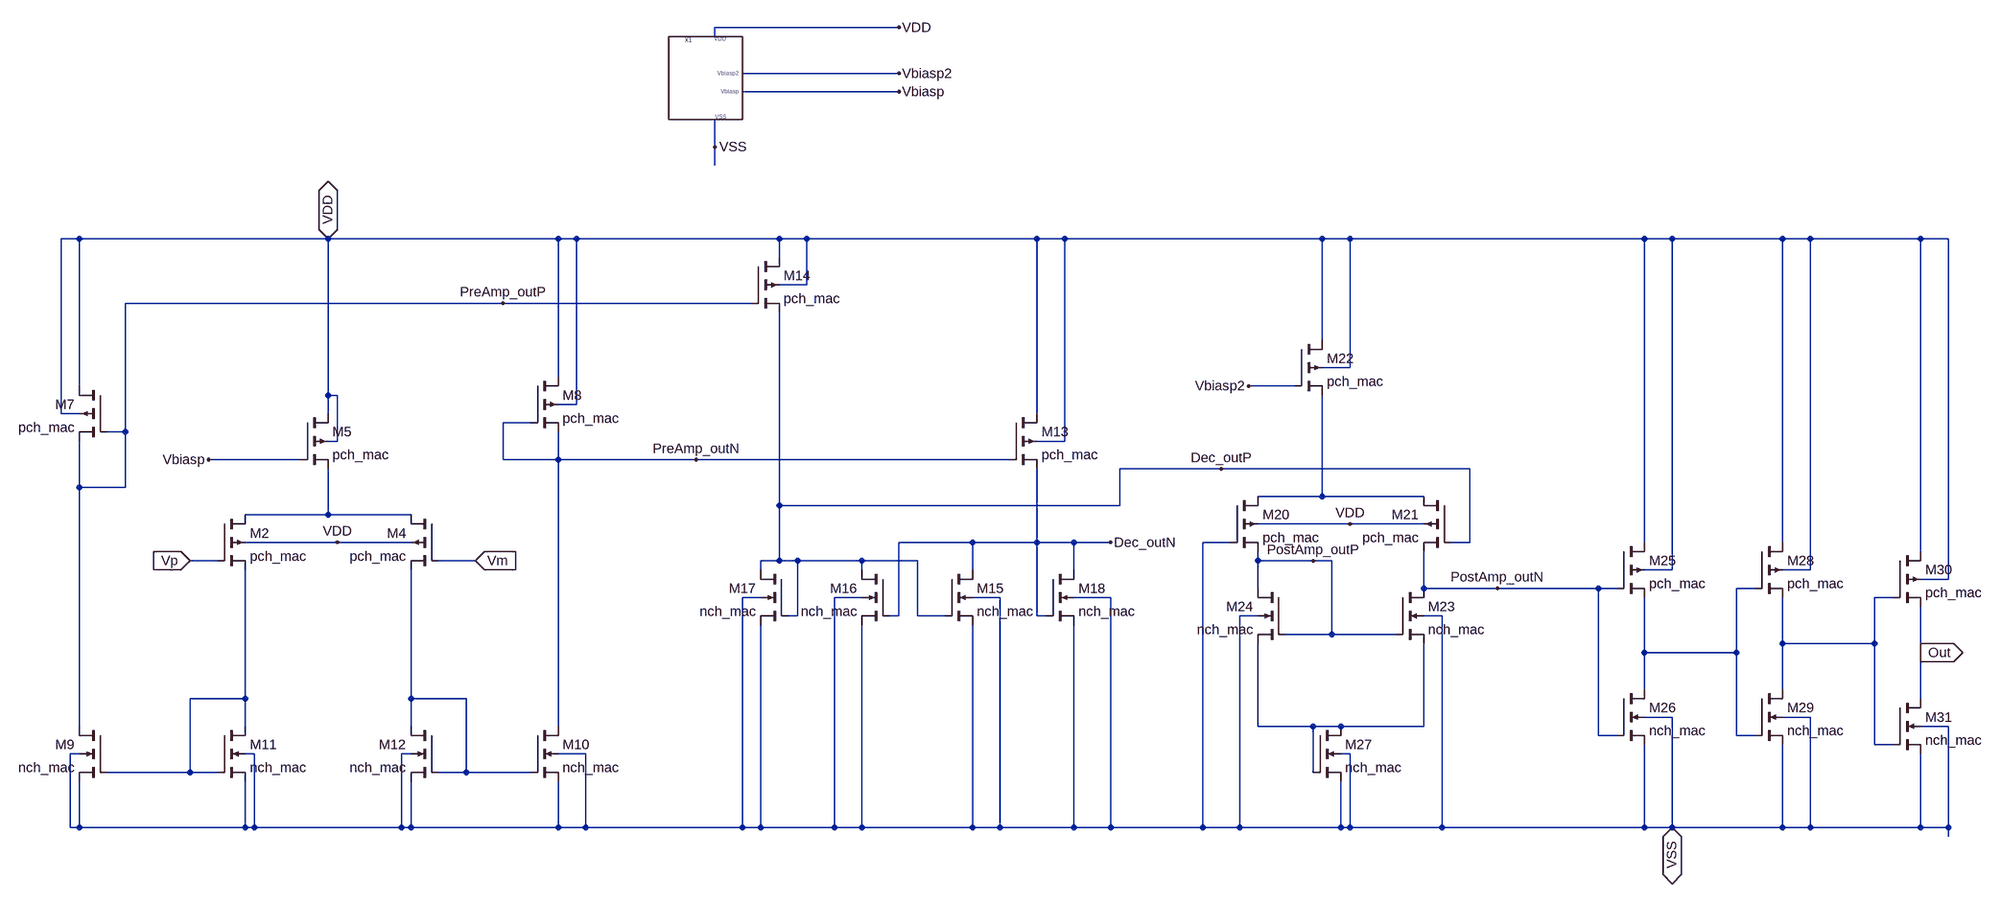
[diagram p0: schematic comparator.asc]
comparator.asc, the LTspice schematic file:
Version 4
SHEET 1 3148 740
WIRE 608 -848 288 -848
WIRE 288 -832 288 -848
WIRE 608 -768 336 -768
WIRE 608 -736 336 -736
WIRE 288 -640 288 -688
WIRE 288 -608 288 -640
WIRE -816 -480 -848 -480
WIRE -384 -480 -816 -480
WIRE 16 -480 -384 -480
WIRE 48 -480 16 -480
WIRE 400 -480 48 -480
WIRE 448 -480 400 -480
WIRE 848 -480 448 -480
WIRE 896 -480 848 -480
WIRE 1344 -480 896 -480
WIRE 1392 -480 1344 -480
WIRE 1904 -480 1392 -480
WIRE 1952 -480 1904 -480
WIRE 2144 -480 1952 -480
WIRE 2192 -480 2144 -480
WIRE 2384 -480 2192 -480
WIRE 2432 -480 2384 -480
WIRE 400 -448 400 -480
WIRE 448 -400 448 -480
WIRE 448 -400 400 -400
WIRE -80 -368 -736 -368
WIRE 352 -368 -80 -368
WIRE 1344 -304 1344 -480
WIRE 1392 -256 1392 -480
WIRE 1392 -256 1344 -256
WIRE 16 -240 16 -480
WIRE -816 -224 -816 -480
WIRE 1296 -224 1216 -224
WIRE -384 -208 -384 -480
WIRE -368 -208 -384 -208
WIRE 48 -192 48 -480
WIRE 48 -192 16 -192
WIRE -848 -176 -848 -480
WIRE -816 -176 -848 -176
WIRE -384 -176 -384 -208
WIRE 848 -176 848 -480
WIRE -32 -160 -80 -160
WIRE -736 -144 -736 -368
WIRE -736 -144 -768 -144
WIRE -368 -128 -368 -208
WIRE -368 -128 -384 -128
WIRE 896 -128 896 -480
WIRE 896 -128 848 -128
WIRE -432 -96 -592 -96
WIRE -80 -96 -80 -160
WIRE 16 -96 16 -144
WIRE 16 -96 -80 -96
WIRE 256 -96 16 -96
WIRE 800 -96 256 -96
WIRE 1168 -80 992 -80
WIRE 1600 -80 1168 -80
WIRE -816 -48 -816 -128
WIRE -736 -48 -736 -144
WIRE -736 -48 -816 -48
WIRE 1344 -32 1344 -208
WIRE 1344 -32 1232 -32
WIRE 1520 -32 1344 -32
WIRE 400 -16 400 -352
WIRE 992 -16 992 -80
WIRE 992 -16 400 -16
WIRE -384 0 -384 -80
WIRE -384 0 -528 0
WIRE -240 0 -384 0
WIRE 1392 16 1232 16
WIRE 1520 16 1392 16
WIRE -368 48 -528 48
WIRE -240 48 -368 48
WIRE 736 48 608 48
WIRE 848 48 848 -80
WIRE 848 48 736 48
WIRE 912 48 848 48
WIRE 976 48 912 48
WIRE 1184 48 1136 48
WIRE 1600 48 1600 -80
WIRE 1600 48 1568 48
WIRE 1904 48 1904 -480
WIRE 2144 48 2144 -480
WIRE 2384 64 2384 -480
WIRE -576 80 -624 80
WIRE -128 80 -192 80
WIRE 400 80 400 -16
WIRE 400 80 368 80
WIRE 432 80 400 80
WIRE 544 80 432 80
WIRE 640 80 544 80
WIRE 1232 80 1232 64
WIRE 1328 80 1232 80
WIRE 1360 80 1328 80
WIRE 368 96 368 80
WIRE 544 96 544 80
WIRE 736 96 736 48
WIRE 912 96 912 48
WIRE 1952 96 1952 -480
WIRE 1952 96 1904 96
WIRE 2192 96 2192 -480
WIRE 2192 96 2144 96
WIRE 2432 112 2432 -480
WIRE 2432 112 2384 112
WIRE 1232 128 1232 80
WIRE 1520 128 1520 64
WIRE 1648 128 1520 128
WIRE 1824 128 1648 128
WIRE 1856 128 1824 128
WIRE 2096 128 2064 128
WIRE 368 144 336 144
WIRE 544 144 496 144
WIRE 784 144 736 144
WIRE 976 144 912 144
WIRE 2336 144 2304 144
WIRE 432 176 432 80
WIRE 432 176 416 176
WIRE 608 176 608 48
WIRE 608 176 592 176
WIRE 640 176 640 80
WIRE 688 176 640 176
WIRE 848 176 848 48
WIRE 864 176 848 176
WIRE 1232 176 1200 176
WIRE 1552 176 1520 176
WIRE 1360 208 1360 80
WIRE 1360 208 1280 208
WIRE 1472 208 1360 208
WIRE 2144 224 2144 144
WIRE 2304 224 2304 144
WIRE 2304 224 2144 224
WIRE 1904 240 1904 144
WIRE 2064 240 2064 128
WIRE 2064 240 1904 240
WIRE 2384 240 2384 160
WIRE 1904 304 1904 240
WIRE 2144 304 2144 224
WIRE -528 320 -528 96
WIRE -528 320 -624 320
WIRE -240 320 -240 96
WIRE -144 320 -240 320
WIRE 2384 320 2384 240
WIRE 1952 352 1904 352
WIRE 2192 352 2144 352
WIRE -816 368 -816 -48
WIRE -528 368 -528 320
WIRE -240 368 -240 320
WIRE 16 368 16 -96
WIRE 1232 368 1232 224
WIRE 1328 368 1232 368
WIRE 1376 368 1328 368
WIRE 1520 368 1520 224
WIRE 1520 368 1376 368
WIRE 2432 368 2384 368
WIRE 1824 384 1824 128
WIRE 1856 384 1824 384
WIRE 2064 384 2064 240
WIRE 2096 384 2064 384
WIRE 2304 400 2304 224
WIRE 2336 400 2304 400
WIRE -816 416 -832 416
WIRE -512 416 -528 416
WIRE -240 416 -256 416
WIRE 64 416 16 416
WIRE 1392 416 1376 416
WIRE -624 448 -624 320
WIRE -624 448 -768 448
WIRE -576 448 -624 448
WIRE -144 448 -144 320
WIRE -144 448 -192 448
WIRE -32 448 -144 448
WIRE 1328 448 1328 368
WIRE -832 544 -832 416
WIRE -816 544 -816 464
WIRE -816 544 -832 544
WIRE -528 544 -528 464
WIRE -528 544 -816 544
WIRE -512 544 -512 416
WIRE -512 544 -528 544
WIRE -256 544 -256 416
WIRE -256 544 -512 544
WIRE -240 544 -240 464
WIRE -240 544 -256 544
WIRE 16 544 16 464
WIRE 16 544 -240 544
WIRE 64 544 64 416
WIRE 64 544 16 544
WIRE 336 544 336 144
WIRE 336 544 64 544
WIRE 368 544 368 192
WIRE 368 544 336 544
WIRE 496 544 496 144
WIRE 496 544 368 544
WIRE 544 544 544 192
WIRE 544 544 496 544
WIRE 736 544 736 192
WIRE 736 544 544 544
WIRE 784 544 784 144
WIRE 784 544 736 544
WIRE 912 544 912 192
WIRE 912 544 784 544
WIRE 976 544 976 144
WIRE 976 544 912 544
WIRE 1136 544 1136 48
WIRE 1136 544 976 544
WIRE 1200 544 1200 176
WIRE 1200 544 1136 544
WIRE 1376 544 1376 464
WIRE 1376 544 1200 544
WIRE 1392 544 1392 416
WIRE 1392 544 1376 544
WIRE 1552 544 1552 176
WIRE 1552 544 1392 544
WIRE 1904 544 1904 400
WIRE 1904 544 1552 544
WIRE 1952 544 1952 352
WIRE 1952 544 1904 544
WIRE 2144 544 2144 400
WIRE 2144 544 1952 544
WIRE 2192 544 2192 352
WIRE 2192 544 2144 544
WIRE 2384 544 2384 416
WIRE 2384 544 2192 544
WIRE 2432 544 2432 368
WIRE 2432 544 2384 544
WIRE 2432 560 2432 544
FLAG -384 -480 VDD
IOPIN -384 -480 BiDir
FLAG -368 48 VDD
FLAG -624 80 Vp
IOPIN -624 80 In
FLAG -128 80 Vm
IOPIN -128 80 In
FLAG 608 -736 Vbiasp
FLAG 608 -848 VDD
FLAG -80 -368 PreAmp_outP
FLAG 256 -96 PreAmp_outN
FLAG 976 48 Dec_outN
FLAG 1952 544 VSS
IOPIN 1952 544 BiDir
FLAG 1392 16 VDD
FLAG 1216 -224 Vbiasp2
FLAG 1168 -80 Dec_outP
FLAG 1328 80 PostAmp_outP
FLAG 1648 128 PostAmp_outN
FLAG 2384 240 Out
IOPIN 2384 240 Out
FLAG 608 -768 Vbiasp2
FLAG -592 -96 Vbiasp
FLAG 288 -640 VSS
SYMBOL pmos4 -576 0 R0
SYMATTR InstName M2
SYMATTR Value pch_mac
SYMATTR Value2 l=1u w=20u
SYMBOL pmos4 -192 0 M0
SYMATTR InstName M4
SYMATTR Value pch_mac
SYMATTR Value2 l=1u w=20u
SYMBOL pmos4 -432 -176 R0
SYMATTR InstName M5
SYMATTR Value pch_mac
SYMATTR Value2 l=2u w=20u
SYMBOL pmos4 -768 -224 M0
SYMATTR InstName M7
SYMATTR Value pch_mac
SYMATTR Value2 l=1u w=20u
SYMBOL pmos4 -32 -240 R0
SYMATTR InstName M8
SYMATTR Value pch_mac
SYMATTR Value2 l=1u w=20u
SYMBOL nmos4 -768 368 M0
SYMATTR InstName M9
SYMATTR Value nch_mac
SYMATTR Value2 l=1u w=10u
SYMBOL nmos4 -32 368 R0
SYMATTR InstName M10
SYMATTR Value nch_mac
SYMATTR Value2 l=1u w=10u
SYMBOL nmos4 -576 368 R0
SYMATTR InstName M11
SYMATTR Value nch_mac
SYMATTR Value2 l=1u w=10u
SYMBOL nmos4 -192 368 M0
SYMATTR InstName M12
SYMATTR Value nch_mac
SYMATTR Value2 l=1u w=10u
SYMBOL pmos4 800 -176 R0
SYMATTR InstName M13
SYMATTR Value pch_mac
SYMATTR Value2 l=1u w=20u
SYMBOL pmos4 352 -448 R0
SYMATTR InstName M14
SYMATTR Value pch_mac
SYMATTR Value2 l=1u w=20u
SYMBOL nmos4 688 96 R0
SYMATTR InstName M15
SYMATTR Value nch_mac
SYMATTR Value2 l=1u w=11u
SYMBOL nmos4 592 96 M0
SYMATTR InstName M16
SYMATTR Value nch_mac
SYMATTR Value2 l=1u w=11u
SYMBOL nmos4 416 96 M0
SYMATTR InstName M17
SYMATTR Value nch_mac
SYMATTR Value2 l=1u w=10u
SYMBOL nmos4 864 96 R0
SYMATTR InstName M18
SYMATTR Value nch_mac
SYMATTR Value2 l=1u w=10u
SYMBOL BiasCircuit 272 -752 R0
SYMATTR InstName X1
SYMBOL pmos4 1184 -32 R0
SYMATTR InstName M20
SYMATTR Value pch_mac
SYMATTR Value2 l=1u w=10u
SYMBOL pmos4 1568 -32 M0
SYMATTR InstName M21
SYMATTR Value pch_mac
SYMATTR Value2 l=1u w=10u
SYMBOL pmos4 1296 -304 R0
SYMATTR InstName M22
SYMATTR Value pch_mac
SYMATTR Value2 l=1u w=20u
SYMBOL nmos4 1472 128 R0
SYMATTR InstName M23
SYMATTR Value nch_mac
SYMATTR Value2 l=0.18u w=6u
SYMBOL nmos4 1280 128 M0
SYMATTR InstName M24
SYMATTR Value nch_mac
SYMATTR Value2 l=0.18u w=6u
SYMBOL pmos4 1856 48 R0
SYMATTR InstName M25
SYMATTR Value pch_mac
SYMATTR Value2 l=0.18u w=1u
SYMBOL nmos4 1856 304 R0
SYMATTR InstName M26
SYMATTR Value nch_mac
SYMATTR Value2 l=0.18u w=0.5u
SYMBOL nmos4 1328 368 R0
SYMATTR InstName M27
SYMATTR Value nch_mac
SYMATTR Value2 l=20u w=20u
SYMBOL pmos4 2096 48 R0
SYMATTR InstName M28
SYMATTR Value pch_mac
SYMATTR Value2 l=0.5u w=5u
SYMBOL nmos4 2096 304 R0
SYMATTR InstName M29
SYMATTR Value nch_mac
SYMATTR Value2 l=0.5u w=2.5u
SYMBOL pmos4 2336 64 R0
SYMATTR InstName M30
SYMATTR Value pch_mac
SYMATTR Value2 l=0.5u w=5u
SYMBOL nmos4 2336 320 R0
SYMATTR InstName M31
SYMATTR Value nch_mac
SYMATTR Value2 l=0.5u w=2.5u

The netlist it stands for:
* comparator.asc
M2 N002 Vp N005 VDD pch_mac l=1u w=20u
M4 N002 Vm N006 VDD pch_mac l=1u w=20u
M5 VDD Vbiasp N002 VDD pch_mac l=2u w=20u
M7 VDD PreAmp_outP PreAmp_outP VDD pch_mac l=1u w=20u
M8 VDD PreAmp_outN PreAmp_outN VDD pch_mac l=1u w=20u
M9 PreAmp_outP N005 VSS VSS nch_mac l=1u w=10u
M10 PreAmp_outN N006 VSS VSS nch_mac l=1u w=10u
M11 N005 N005 VSS VSS nch_mac l=1u w=10u
M12 N006 N006 VSS VSS nch_mac l=1u w=10u
M13 VDD PreAmp_outN Dec_outN VDD pch_mac l=1u w=20u
M14 VDD PreAmp_outP Dec_outP VDD pch_mac l=1u w=20u
M15 Dec_outN Dec_outP VSS VSS nch_mac l=1u w=11u
M16 Dec_outP Dec_outN VSS VSS nch_mac l=1u w=11u
M17 Dec_outP Dec_outP VSS VSS nch_mac l=1u w=10u
M18 Dec_outN Dec_outN VSS VSS nch_mac l=1u w=10u
XX1 VDD VSS Vbiasp Vbiasp2 BiasCircuit  ; pins VDD VSS Vbiasp Vbiasp2
M20 N001 VSS PostAmp_outP VDD pch_mac l=1u w=10u
M21 N001 Dec_outP PostAmp_outN VDD pch_mac l=1u w=10u
M22 VDD Vbiasp2 N001 VDD pch_mac l=1u w=20u
M23 PostAmp_outN PostAmp_outP N007 VSS nch_mac l=0.18u w=6u
M24 PostAmp_outP PostAmp_outP N007 VSS nch_mac l=0.18u w=6u
M25 VDD PostAmp_outN N003 VDD pch_mac l=0.18u w=1u
M26 N003 PostAmp_outN VSS VSS nch_mac l=0.18u w=0.5u
M27 N007 N007 VSS VSS nch_mac l=20u w=20u
M28 VDD N003 N004 VDD pch_mac l=0.5u w=5u
M29 N004 N003 VSS VSS nch_mac l=0.5u w=2.5u
M30 VDD N004 Out VDD pch_mac l=0.5u w=5u
M31 Out N004 VSS VSS nch_mac l=0.5u w=2.5u
.model NMOS NMOS
.model PMOS PMOS
.lib standard.mos
.backanno
.end